# EAGLE schematic door_unlocker (EAGLE 7.7.0)
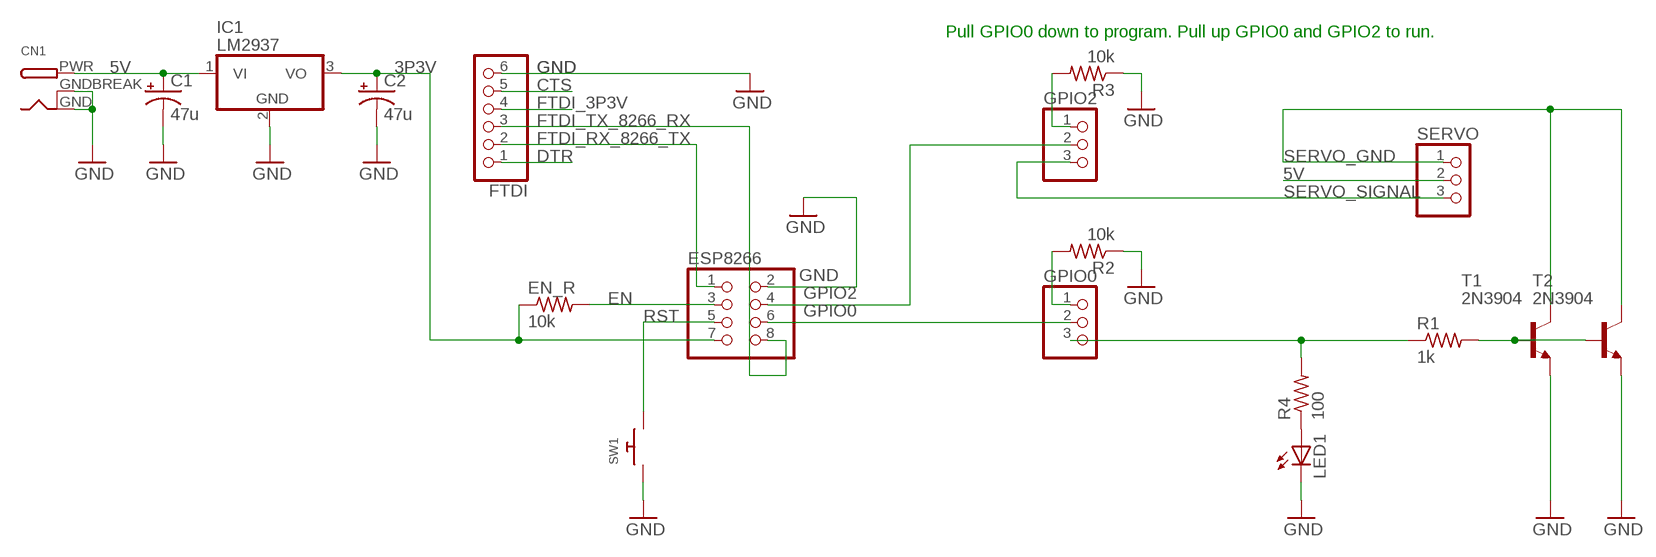
[diagram p0: schematic, sheet 1]

## Parts
C1  47u  CPOL-USE2,5-6E  [E2,5-6E]
C2  47u  CPOL-USE2,5-6E  [E2,5-6E]
CN1  DCBARRELPTH  [DCJACK_2MM_PTH]
EN_R  10k  R-US_0207/10  [0207/10]
ESP8266  PINHD-2X4  [2X04]
FTDI  PINHD-1X6  [1X06]
GPIO0  PINHD-1X3  [1X03]
GPIO2  PINHD-1X3  [1X03]
IC1  LM2937  [TO263-3]
LED1  LED5MM  [LED5MM]
R1  1k  R-US_0207/10  [0207/10]
R2  10k  R-US_0207/10  [0207/10]
R3  10k  R-US_0207/10  [0207/10]
R4  100  R-US_0207/10  [0207/10]
SERVO  PINHD-1X3  [1X03]
SW1  SWITCH_PUSHBUTTONEVQ-PE  [TACT_PANA-EVQ]
T1  2N3904  [TO92]
T2  2N3904  [TO92]

## Nets
3P3V: C2.+ EN_R.1 ESP8266.7 IC1.3(VO)
5V: C1.+ CN1.PWR IC1.1(VI) SERVO.2
CTS: FTDI.5
DTR: FTDI.1
EN: EN_R.2 ESP8266.3
FTDI_3P3V: FTDI.4
FTDI_RX_8266_TX: ESP8266.1 FTDI.2
FTDI_TX_8266_RX: ESP8266.8 FTDI.3
GND: C1.- C2.- CN1.GND CN1.GNDBREAK ESP8266.2 FTDI.6 IC1.2(GND) LED1.K(C) R2.1 R3.1 SW1.P$1 T1.3(E) T2.3(E)
GPIO0: ESP8266.6 GPIO0.2
GPIO2: ESP8266.4 GPIO2.2
N$1: GPIO0.1 R2.2
N$2: LED1.A R4.1
N$4: GPIO2.1 R3.2
N$7: GPIO0.3 R1.1 R4.2
N$8: R1.2 T1.2(B) T2.2(B)
RST: ESP8266.5 SW1.P$2
SERVO_GND: SERVO.1 T1.1(C) T2.1(C)
SERVO_SIGNAL: GPIO2.3 SERVO.3

## Notes on the sheet
- Pull GPIO0 down to program. Pull up GPIO0 and GPIO2 to run.

## Library data of the parts
C1 C2 = resistor:CPOL-US: POLARIZED CAPACITOR, American symbol
CN1 = adafruit:DCBARREL: 2.0mm DC Barrel Jack DCJACK_2MM_PTH - Through Hole Jack (4UConnector: 05537)
EN_R R1-R4 = resistor:R-US_: RESISTOR, American symbol
ESP8266 = adafruit:PINHD-2X4: PIN HEADER
FTDI = adafruit:PINHD-1X6: PIN HEADER
GPIO0 GPIO2 SERVO = adafruit:PINHD-1X3: PIN HEADER
IC1 = linear:LM2937: LM2937-2.5, LM2937-3.3 400mA and 500mA Voltage Regulators Source: http://cache.national.com/ds/LM/LM2937-2.5.pdf
LED1 = led:LED: LED OSRAM: - CHIPLED LG R971, LG N971, LY N971, LG Q971, LY Q971, LO R971, LY R971 LH N974, LH R974 LS Q976, LO Q976, LY Q976 LO Q996 - Hyper CHIPLED LW Q18S LB Q993, LB Q99A, LB R99A - SideLED LS A670, LO A670, LY A670, LG A670, LP A670 LB A673, LV A673, LT A673, LW A673 LH A674 LY A675 LS A676, LA A676, LO A676, LY A676, LW A676 LS A679, LY A679, LG A679 - Hyper Micro SIDELED® LS Y876, LA Y876, LO Y876, LY Y876 LT Y87S - SmartLED LW L88C, LW L88S LB L89C, LB L89S, LG L890 LS L89K, LO L89K, LY L89K LS L896, LA L896, LO L896, LY L896 - TOPLED LS T670, LO T670, LY T670, LG T670, LP T670 LSG T670, LSP T670, LSY T670, LOP T670, LYG T670 LG T671, LOG T671, LSG T671 LB T673, LV T673, LT T673, LW T673 LH T674 LS T676, LA T676, LO T676, LY T676, LB T676, LH T676, LSB T676, LW T676 LB T67C, LV T67C, LT T67C, LS T67K, LO T67K, LY T67K, LW E67C LS E67B, LA E67B, LO E67B, LY E67B, LB E67C, LV E67C, LT E67C LW T67C LS T679, LY T679, LG T679 LS T770, LO T770, LY T770, LG T770, LP T770 LB T773, LV T773, LT T773, LW T773 LH T774 LS E675, LA E675, LY E675, LS T675 LS T776, LA T776, LO T776, LY T776, LB T776 LHGB T686 LT T68C, LB T68C - Hyper Mini TOPLED® LB M676 - Mini TOPLED Santana® LG M470 LS M47K, LO M47K, LY M47K Source: http://www.osram.convergy.de LUXEON: - LUMILED® LXK2-PW12-R00, LXK2-PW12-S00, LXK2-PW14-U00, LXK2-PW14-V00 LXK2-PM12-R00, LXK2-PM12-S00, LXK2-PM14-U00 LXK2-PE12-Q00, LXK2-PE12-R00, LXK2-PE12-S00, LXK2-PE14-T00, LXK2-PE14-U00 LXK2-PB12-K00, LXK2-PB12-L00, LXK2-PB12-M00, LXK2-PB14-N00, LXK2-PB14-P00, LXK2-PB14-Q00 LXK2-PR12-L00, LXK2-PR12-M00, LXK2-PR14-Q00, LXK2-PR14-R00 LXK2-PD12-Q00, LXK2-PD12-R00, LXK2-PD12-S00 LXK2-PH12-R00, LXK2-PH12-S00 LXK2-PL12-P00, LXK2-PL12-Q00, LXK2-PL12-R00 Source: www.luxeon.com KINGBRIGHT: KA-3528ASYC Source: www.kingbright.com
SW1 = adafruit:SWITCH_PUSHBUTTON: Buttons SOFTTOUCHSMD_SJ - Soft touch temporary push button (Super Junk Akihabara) Compatible with SKPMANE010 [Mouser: 688-SKPMAN] C&K_KSS = Digikey: KSS221GLFS
T1 T2 = transistor:2N3904: NPN TRANSISTOR